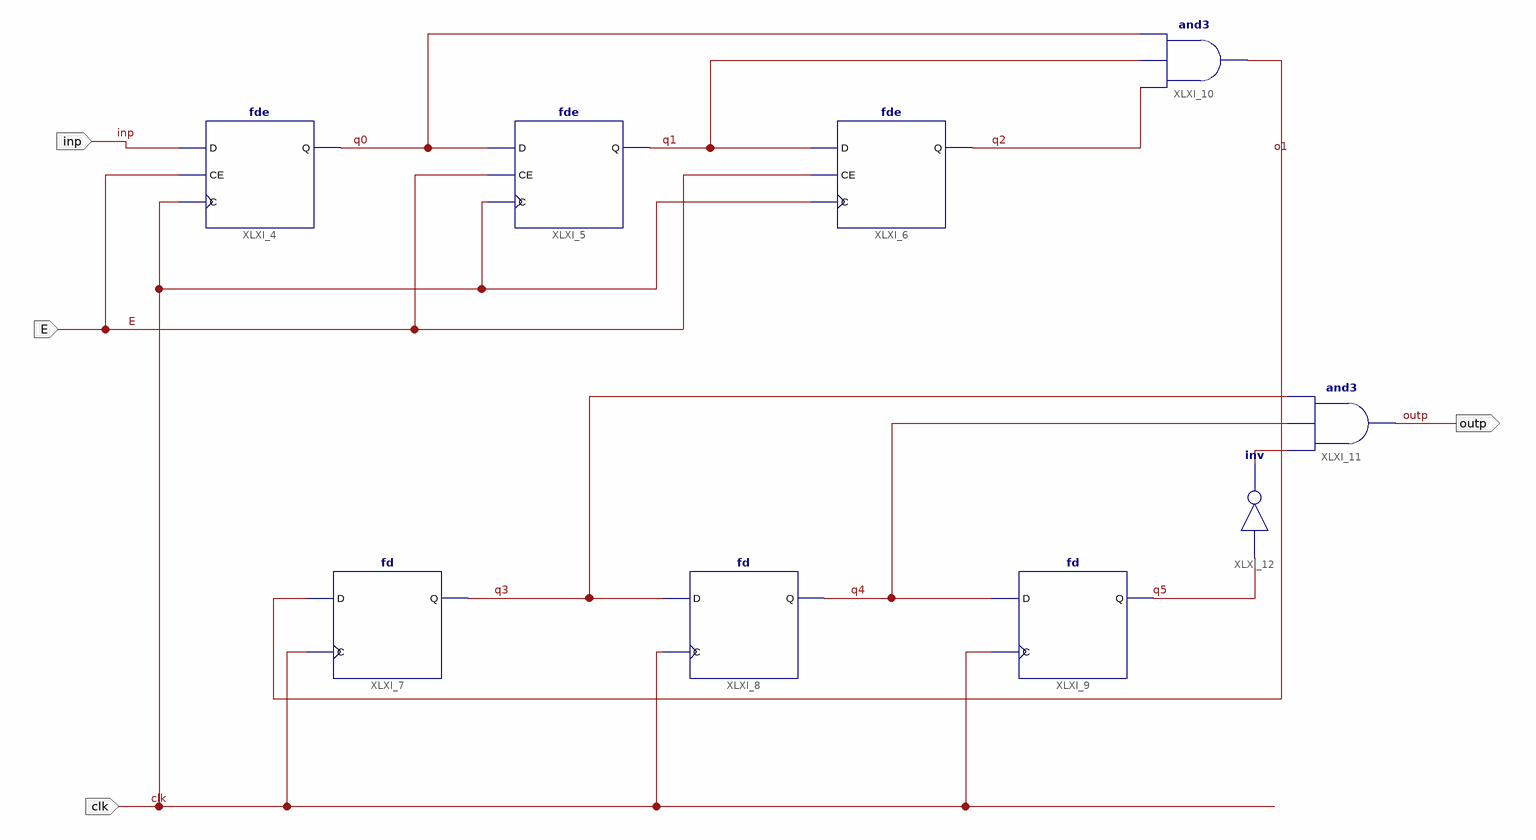
[diagram p0: schematic sheet 1]
// Xilinx ISE schematic pulse.sch (spartan6) as structural Verilog: 9 symbols, 4 ports
module pulse (
  input  clk,
  input  inp,
  input  E,
  output outp
);

  wire o1, q0, q1, q2, q3, q4, q5, XLXN_9;

  fde XLXI_4 (.C(clk), .CE(E), .D(inp), .Q(q0));
  fde XLXI_5 (.C(clk), .CE(E), .D(q0), .Q(q1));
  fde XLXI_6 (.C(clk), .CE(E), .D(q1), .Q(q2));
  fd XLXI_7 (.C(clk), .D(o1), .Q(q3));
  fd XLXI_8 (.C(clk), .D(q3), .Q(q4));
  fd XLXI_9 (.C(clk), .D(q4), .Q(q5));
  and XLXI_10 (o1, q2, q1, q0);
  and XLXI_11 (outp, XLXN_9, q4, q3);
  not XLXI_12 (XLXN_9, q5);
endmodule
